# EasyEDA Pro project FPGC-CycloneIV-AIO.eprj, board PCB1
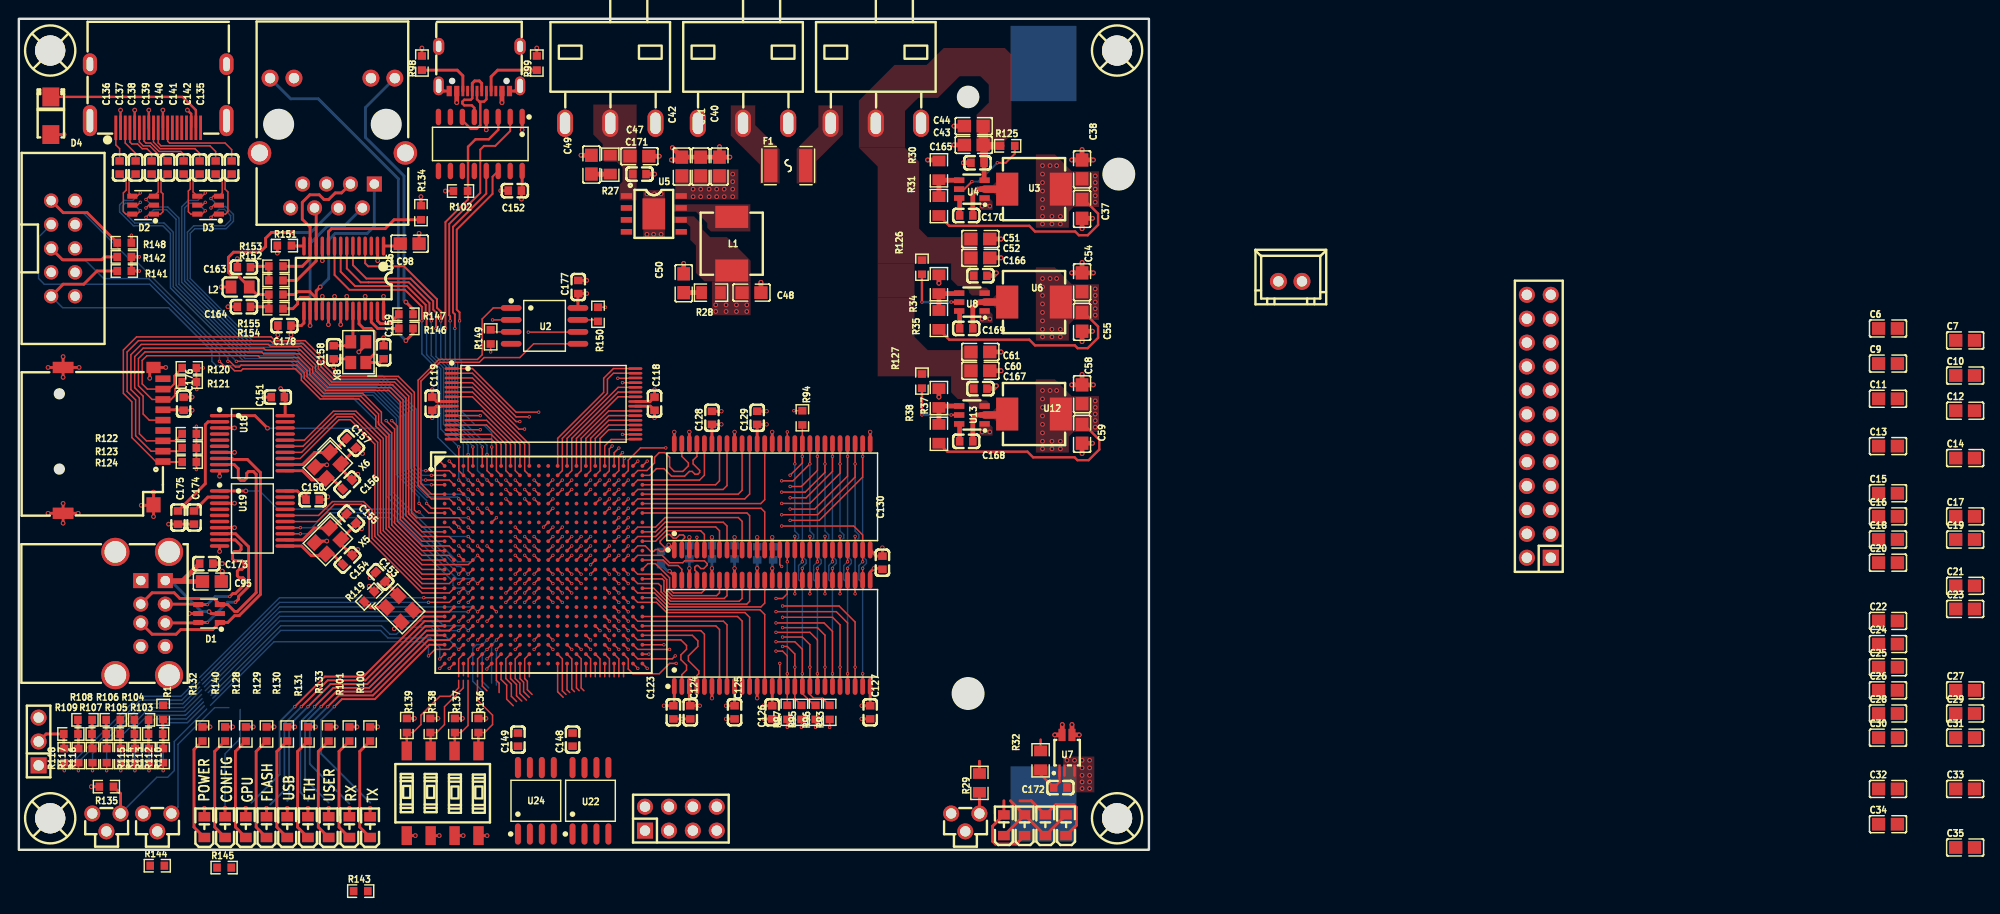
[diagram p4: board, top side]
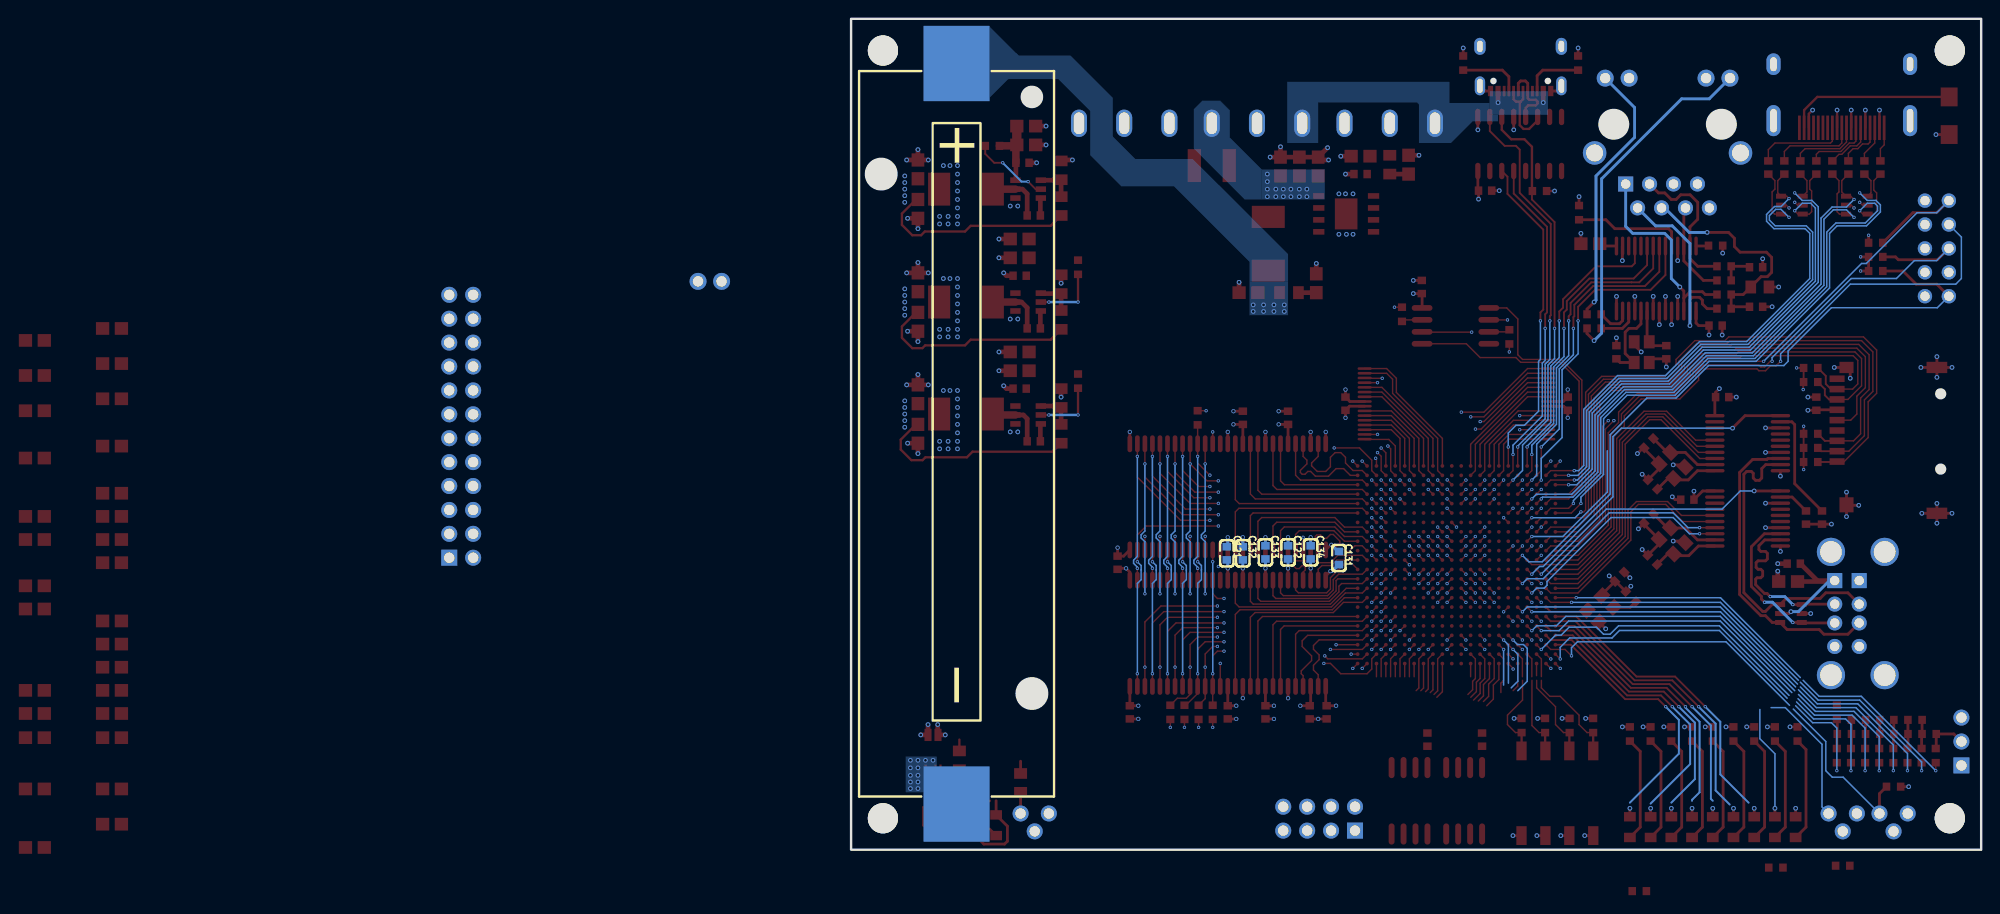
[diagram p5: board, bottom side, seen from below]

Outline 120 x 88.3 mm; copper layers: Top Layer, Inner1, Inner2, Inner3, Inner4, Bottom Layer. Coordinates in mm from the lower left corner of the outline.
Outline path: rectangle 0,88.3 120,0
Stack: Top Layer 0.035mm Outer layer thickness 1oz / Dielectric1 0.0994mm 3313 RC57% 4.2mil / Inner1 0.0152mm Inner layer thickness / Dielectric2 0.55mm 0.55mm H/H No copper / Inner2 0.0152mm Inner layer thickness / Dielectric3 0.1088mm 2116 RC54% 4.9mil / Inner3 0.0152mm Inner layer thickness / Dielectric4 0.55mm 0.55mm H/H No copper / Inner4 0.0152mm Inner layer thickness / Dielectric5 0.0994mm 3313 RC57% 4.2mil / Bottom Layer 0.035mm Outer layer thickness 1oz

## Design rules (mm)
net HDMI_D2P: DP1
net HDMI_D2N: DP1
net HDMI_D1P: DP2
net HDMI_D1N: DP2
net HDMI_D0P: DP3
net HDMI_D0N: DP3
net HDMI_CLKP: DP4
net HDMI_CLKN: DP4
net $6N7003: DP6
net $6N7006: DP6
net $6N102284: DP5
net $6N102280: DP5
template: JLCPCB Capability(Multiple Layers Board)
spacing copperThickness1oz (default): track to track 0.102, other pairs 0.152 to 0.3
spacing copperThickness2oz: track to track 0.203, other pairs 0.152 to 0.3
spacing copperThicknessInner0.5oz: track to track 0.089, other pairs 0.152 to 0.3
track width copperThickness1oz (default): min 0.102, default 0.254, max 2.54
track width copperThickness2oz: min 0.203, default 0.254, max 2.54
track width copperThickness0.5oz: min 0.089, default 0.254, max 2.54
differential pair differentialPair (default): width min 0.127, default 0.254, max 2.54; gap min 0.152, default 0.152
via viaSize (default): diameter min 0.3, default 0.61, max 10; hole min 0.2, default 0.305, max 6.3

## Placement (name value [footprint] x y rotation side)
BAT1  1042  [BAT-SMD_1042P]  108.8 44.2 90 bottom
C6  10nF  [C0805]  198.48 55.39 0 top
C7  10nF  [C0805]  206.67 54.12 0 top
C9  10nF  [C0805]  198.48 51.66 0 top
C10  10nF  [C0805]  206.67 50.39 0 top
C11  10nF  [C0805]  198.48 47.92 0 top
C12  10nF  [C0805]  206.67 46.65 0 top
C13  10nF  [C0805]  198.48 42.89 0 top
C14  10nF  [C0805]  206.67 41.62 0 top
C15  10nF  [C0805]  198.48 37.88 0 top
C16  10nF  [C0805]  198.48 35.42 0 top
C17  100nF  [C0805]  206.67 35.42 0 top
C18  10nF  [C0805]  198.48 32.96 0 top
C19  100nF  [C0805]  206.67 32.96 0 top
C20  10nF  [C0805]  198.48 30.5 0 top
C21  10uF  [C0805]  206.67 28.04 0 top
C22  100nF  [C0805]  198.48 24.31 0 top
C23  10uF  [C0805]  206.67 25.58 0 top
C24  100nF  [C0805]  198.48 21.85 0 top
C25  100nF  [C0805]  198.48 19.39 0 top
C26  100nF  [C0805]  198.48 16.93 0 top
C27  100nF  [C0805]  206.67 16.93 0 top
C28  100nF  [C0805]  198.48 14.47 0 top
C29  100nF  [C0805]  206.67 14.47 0 top
C30  100nF  [C0805]  198.48 11.91 0 top
C31  100nF  [C0805]  206.67 11.91 0 top
C32  100nF  [C0805]  198.48 6.46 0 top
C33  100nF  [C0805]  206.67 6.46 0 top
C34  100nF  [C0805]  198.48 2.71 0 top
C35  10uF  [C0805]  206.67 0.24 0 top
C37  22uF  [C0805]  112.9 68.1 90 top
C38  22uF  [C0805]  112.9 72.3 270 top
C40  22uF  [C0805]  74.4 72.6 270 top
C41  22uF  [C0805]  72.4 72.6 270 top
C42  22uF  [C0805]  70.4 72.6 270 top
C43  10uF  [C0805]  101.4 74.9 0 top
C44  10uF  [C0805]  101.4 76.9 0 top
C47  10uF  [C0805]  65.9 73.7 180 top
C48  10uF  [C0805]  77.8 59.2 180 top
C49  10uF  [C0805]  60.8 72.8 270 top
C50  10uF  [C0805]  70.6 60.2 270 top
C51  10uF  [C0805]  102.1 64.9 180 top
C52  10uF  [C0805]  102.1 62.9 180 top
C54  22uF  [C0805]  112.9 60.3 270 top
C55  22uF  [C0805]  112.9 56.1 90 top
C58  22uF  [C0805]  112.9 48.4 270 top
C59  22uF  [C0805]  112.9 44.2 90 top
C60  10uF  [C0805]  102.1 50.9 180 top
C61  10uF  [C0805]  102.1 52.9 180 top
C95  22uF  [C0805]  20.5 28.5 0 top
C98  10uF  [C0805]  41.5 64.4 180 top
C118  100nF  [C0603]  67.5 47.4 90 top
C119  100nF  [C0603]  43.9 47.4 90 top
C121  100nF  [C0603]  80.1 31.5 270 bottom
C122  100nF  [C0603]  73.6 31.6 90 bottom
C123  100nF  [C0603]  69.5 14.6 270 top
C124  100nF  [C0603]  71.3 14.6 270 top
C125  100nF  [C0603]  76 14.6 270 top
C126  100nF  [C0603]  80 14.6 270 top
C127  100nF  [C0603]  90.4 14.6 270 top
C128  100nF  [C0603]  73.6 45.9 90 top
C129  100nF  [C0603]  78.4 45.9 90 top
C130  100nF  [C0603]  91.7 30.5 270 top
C131  100nF  [C0603]  68.2 31 270 bottom
C132  100nF  [C0603]  78.4 31.5 90 bottom
C133  100nF  [C0603]  76 31.6 270 bottom
C134  100nF  [C0603]  71.2 31.6 270 bottom
C135  100nF  [C0603]  22.6 72.5 90 top
C136  100nF  [C0603]  10.7 72.5 90 top
C137  100nF  [C0603]  12.4 72.5 90 top
C138  100nF  [C0603]  14.1 72.5 90 top
C139  100nF  [C0603]  15.8 72.5 90 top
C140  100nF  [C0603]  17.5 72.5 90 top
C141  100nF  [C0603]  19.2 72.5 90 top
C142  100nF  [C0603]  20.9 72.5 90 top
C148  100nF  [C0603]  58.8 11.7 90 top
C149  100nF  [C0603]  53 11.7 90 top
C150  100nF  [C0603]  31.2 37.2 0 top
C151  100nF  [C0603]  27.5 48.1 0 top
C152  100nF  [C0603]  52.67 70.04 180 top
C153  100nF  [C0603]  38.4 29 135 top
C154  22pF  [C0603]  34.9 30.8 225 top
C155  22pF  [C0603]  35.3 35.2 135 top
C156  22pF  [C0603]  34.87 38.82 225 top
C157  22pF  [C0603]  35.3 43.2 135 top
C158  22pF  [C0603]  33.43 52.87 90 top
C159  22pF  [C0603]  38.73 52.87 270 top
C163  100nF  [C0603]  23.9 61.9 180 top
C164  100nF  [C0603]  23.9 57.7 180 top
C165  100nF  [C0603]  101.8 73 0 top
C166  100nF  [C0603]  102.1 61 180 top
C167  100nF  [C0603]  102.1 49 180 top
C168  100nF  [C0603]  100.6 43.4 0 top
C169  100nF  [C0603]  100.6 55.4 0 top
C170  100nF  [C0603]  100.6 67.4 0 top
C171  100nF  [C0603]  65.9 71.8 0 top
C172  100nF  [C0603]  110.6 6.6 180 top
C173  100nF  [C0603]  19.9 30.4 180 top
C174  100nF  [C0603]  18.6 35.3 90 top
C175  100nF  [C0603]  16.9 35.3 270 top
C176  100nF  [C0603]  17.5 47.4 90 top
C177  100nF  [C0603]  59.4 59.8 90 top
C178  100nF  [C0603]  28.2 55.7 180 top
CARD1  TF PUSH  [TF-SMD_TF-PUSH]  10 43.5 270 top
CN1  XH-2A  [CONN-TH_XH-2A]  135 60.4 0 top
D1  SRV05-4  [SOT-23-6_L2.9-W1.6-P0.95-LS2.8-BL]  20.2 25.1 90 top
D2  SRV05-4  [SOT-23-6_L2.9-W1.6-P0.95-LS2.8-BL]  13.2 68.5 90 top
D3  SRV05-4  [SOT-23-6_L2.9-W1.6-P0.95-LS2.8-BL]  20.1 68.5 90 top
D4  SS34  [SMA_L4.2-W2.7-LS5.0-RD]  3.4 78 270 top
F1  MF-MSMF110/16-2  [F1812]  81.7 72.7 180 top
H1  PZ254V-12-24P  [HDR-TH_24P-P2.54-V-M-R2-C12-S2.54]  161.4 45 90 top
H2  PZ254V-11-03P  [HDR-TH_3P-P2.54-V-M]  2.1 11.5 90 top
H3  PZ254V-12-8P  [HDR-TH_8P-P2.54-V-M-R2-C4-S2.54]  70.3 3.3 0 top
HDMI1  HDMI 19PIN 043  [HDMI-SMD_HDMI-19PIN-043]  14.8 80.1 180 top
J1  HR911105A  [RJ45-TH_HR911105A]  33.3 75.1 180 top
L1  1uH  [IND-SMD_L7.2-W6.6_GPSR0730]  75.7 64.4 270 top
L2  BLM21PG221SN1D  [L0805]  23.5 59.8 180 top
LED1  XL-2012SURC  [LED0805-RD_RED]  21.9 2.4 90 top
LED2  XL-2012SURC  [LED0805-RD_RED]  104.6 2.6 90 top
LED3  XL-2012SURC  [LED0805-RD_RED]  106.8 2.6 90 top
LED4  XL-2012SURC  [LED0805-RD_RED]  109 2.6 90 top
LED5  XL-2012SURC  [LED0805-RD_RED]  111.2 2.6 90 top
LED6  XL-2012SURC  [LED0805-RD_RED]  24.1 2.4 90 top
LED7  XL-2012SURC  [LED0805-RD_RED]  26.3 2.4 90 top
LED8  XL-2012SURC  [LED0805-RD_RED]  28.5 2.4 90 top
LED9  XL-2012SURC  [LED0805-RD_RED]  30.7 2.4 90 top
LED10  XL-2012SURC  [LED0805-RD_RED]  19.7 2.4 90 top
LED11  XL-2012SURC  [LED0805-RD_RED]  32.9 2.4 90 top
LED12  XL-2012SURC  [LED0805-RD_RED]  37.3 2.4 90 top
LED13  XL-2012SURC  [LED0805-RD_RED]  35.1 2.4 90 top
P1  2.54-2*5P简牛  [IDC-TH_10P-P2.54_C5665]  4.7 63.9 270 top
R27  2Ω  [R0805]  62.8 72.8 90 top
R28  2Ω  [R0805]  73.5 59.2 0 top
R29  10kΩ  [R0805]  102 7.1 90 top
R30  10kΩ  [R0805]  97.7 72.2 270 top
R31  33kΩ  [R0805]  97.7 68.4 270 top
R32  1kΩ  [R0805]  108.5 9.5 270 top
R34  33kΩ  [R0805]  97.7 60.1 90 top
R35  75kΩ  [R0805]  97.7 56.3 270 top
R37  100kΩ  [R0805]  97.7 48 90 top
R38  56kΩ  [R0805]  97.7 44.2 270 top
R93  4.7kΩ  [R0603]  86.1 14.6 90 top
R94  4.7kΩ  [R0603]  83.2 45.9 270 top
R95  4.7kΩ  [R0603]  83.1 14.6 90 top
R96  4.7kΩ  [R0603]  84.6 14.6 90 top
R97  4.7kΩ  [R0603]  81.6 14.6 90 top
R98  5.1kΩ  [R0603]  42.8 83.6 90 top
R99  5.1kΩ  [R0603]  55 83.6 90 top
R100  4.7kΩ  [R0603]  37.3 12.3 270 top
R101  4.7kΩ  [R0603]  35.1 12.3 270 top
R102  10kΩ  [R0603]  46.9 70 0 top
R103  10kΩ  [R0603]  14.52 12.3 0 top
R104  10kΩ  [R0603]  13.02 13.8 0 top
R105  10kΩ  [R0603]  11.52 12.3 0 top
R106  10kΩ  [R0603]  10.02 13.8 0 top
R107  10kΩ  [R0603]  8.52 12.3 0 top
R108  10kΩ  [R0603]  7.02 13.8 0 top
R109  10kΩ  [R0603]  5.52 12.3 0 top
R110  20kΩ  [R0603]  15.32 10 270 top
R111  20kΩ  [R0603]  15.32 14.6 270 top
R112  20kΩ  [R0603]  13.82 10 270 top
R113  20kΩ  [R0603]  12.32 10 270 top
R114  20kΩ  [R0603]  10.82 10 270 top
R115  20kΩ  [R0603]  9.32 10 270 top
R116  20kΩ  [R0603]  7.82 10 270 top
R117  20kΩ  [R0603]  6.32 10 270 top
R118  20kΩ  [R0603]  4.82 10 270 top
R119  4.7kΩ  [R0603]  37.2 26.9 45 top
R120  10kΩ  [R0603]  18.1 51.2 0 top
R121  10kΩ  [R0603]  18.1 49.7 0 top
R122  10kΩ  [R0603]  18.1 44.2 0 top
R123  10kΩ  [R0603]  18.1 42.7 0 top
R124  10kΩ  [R0603]  18.1 41.2 0 top
R125  10kΩ  [R0603]  105 74.8 0 top
R126  10kΩ  [R0603]  95.9 61.9 270 top
R127  10kΩ  [R0603]  95.9 49.8 270 top
R128  4.7kΩ  [R0603]  24.1 12.3 270 top
R129  4.7kΩ  [R0603]  26.3 12.3 270 top
R130  4.7kΩ  [R0603]  28.5 12.3 270 top
R131  4.7kΩ  [R0603]  30.7 12.3 270 top
R132  4.7kΩ  [R0603]  19.5 12.3 270 top
R133  4.7kΩ  [R0603]  32.9 12.3 270 top
R134  10kΩ  [R0603]  42.7 67.7 90 top
R135  10kΩ  [R0603]  9.3 6.7 0 top
R136  10kΩ  [R0603]  48.8 13.2 270 top
R137  10kΩ  [R0603]  46.3 13.2 270 top
R138  10kΩ  [R0603]  43.7 13.2 270 top
R139  10kΩ  [R0603]  41.2 13.2 270 top
R140  4.7kΩ  [R0603]  21.9 12.3 270 top
R141  10kΩ  [R0603]  11.2 61.5 180 top
R142  10kΩ  [R0603]  11.2 63 180 top
R143  10kΩ  [R0603]  36.3 -4.4 0 top
R144  10kΩ  [R0603]  14.7 -1.7 0 top
R145  10kΩ  [R0603]  21.8 -1.9 0 top
R146  1kΩ  [R0603]  41.1 55.4 0 top
R147  1kΩ  [R0603]  41.1 56.9 0 top
R148  1kΩ  [R0603]  11.2 64.5 0 top
R149  1kΩ  [R0603]  50.1 54.5 90 top
R150  1kΩ  [R0603]  61.5 56.9 90 top
R151  2.32kΩ  [R0603]  28.2 64.2 0 top
R152  49.9Ω  [R0603]  27.3 60.5 180 top
R153  49.9Ω  [R0603]  27.3 62 180 top
R154  49.9Ω  [R0603]  27.3 57.5 180 top
R155  49.9Ω  [R0603]  27.3 59 180 top
SCREW1  -  [Screw-Hole-M3]  3.39 84.87 0 top
SCREW2  -  [Screw-Hole-M3]  116.68 84.87 0 top
SCREW3  -  [Screw-Hole-M3]  3.39 3.28 0 top
SCREW4  -  [Screw-Hole-M3]  116.68 3.28 0 top
SW2  TS-1009B-05026  [SW-TH_3P-L4.5-W3.8-P3.10-LS1.9]  14.7 2.9 0 top
SW3  TS-1009B-05026  [SW-TH_3P-L4.5-W3.8-P3.10-LS1.9]  100.5 2.9 0 top
SW4  TS-1009B-05026  [SW-TH_3P-L4.5-W3.8-P3.10-LS1.9]  9.3 2.9 0 top
SW5  2.54-4P TPGT  [SW-SMD_8P-L10.2-W6.2-P2.54-LS9.4]  45 6 90 top
U2  W25Q64JVSSIQ  [SOP-8_L5.3-W5.3-P1.27-LS8.0-BL]  55.82 55.67 270 top
U3  4.7uH  [IND-SMD_L7.2-W6.6_GPSR07X0]  107.8 70.2 180 top
U4  TPS563201DDCR  [SOT-23-6_L2.9-W1.6-P0.95-LS2.8-BR]  101.2 70.2 0 top
U5  IP5306  [ESOP-8_L4.9-W3.9-P1.27-LS6.0-BL-EP]  67.43 67.57 270 top
U6  4.7uH  [IND-SMD_L7.2-W6.6_GPSR07X0]  107.8 58.2 180 top
U7  XB7608AJ  [CPC-5_L2.6-W2.6-P0.53-LS4.0-BL]  111.3 10.3 0 top
U8  TPS563201DDCR  [SOT-23-6_L2.9-W1.6-P0.95-LS2.8-BR]  101.2 58.2 0 top
U9  SS12D10G6-WJ  [SW-TH_3P-P4.80_HX-SS12D10G6-WJ]  62.8 77.2 180 top
U10  SS12D10G6-WJ  [SW-TH_3P-P4.80_HX-SS12D10G6-WJ]  91 77.2 180 top
U11  SS12D10G6-WJ  [SW-TH_3P-P4.80_HX-SS12D10G6-WJ]  76.9 77.2 180 top
U12  4.7uH  [IND-SMD_L7.2-W6.6_GPSR07X0]  107.8 46.3 180 top
U13  TPS563201DDCR  [SOT-23-6_L2.9-W1.6-P0.95-LS2.8-BR]  101.2 46.2 0 top
U14  W9825G6KH-6  [TSOP-54_L22.2-W10.2-P0.80-LS11.8-BL]  80 23 0 top
U15  W9825G6KH-6  [TSOP-54_L22.2-W10.2-P0.80-LS11.8-BL]  80 37.5 0 top
U16  IS63WV1288DBLL-10HLI  [TSOPI-32_L18.4-W8.0-P0.50-LS20.0-TL]  55.71 47.38 0 top
U18  CH376T  [SSOP-20_L7.5-W5.2-P0.65-LS8.0-BL]  24.8 43.2 270 top
U19  CH376T  [SSOP-20_L7.5-W5.2-P0.65-LS8.0-BL]  24.8 35.2 270 top
U22  W25Q128JVSIQ  [SOIC-8_L5.3-W5.3-P1.27-LS8.0-BL]  60.7 5.2 0 top
U23  CH340C  [SOP-16_L10.0-W3.9-P1.27-LS6.0-BL]  49 75 180 top
U24  W25Q128JVSIQ  [SOIC-8_L5.3-W5.3-P1.27-LS8.0-BL]  54.9 5.2 0 top
U25  EP4CE40F23I7N  [FBGA-484_L23.0-W23.0-R22-C22-P1.00-TL]  55.71 30.28 0 top
U26  ENC28J60-I/SS  [SSOP-28_L10.2-W5.3-P0.65-LS7.8-BL]  34.5 60.7 180 top
USB1  AF SS-JB17.6  [USB-A-TH_AF-SS-JB17.6]  13.1 25.1 270 top
USB2  TYPE-C 16PIN 2MD(073)  [USB-C-SMD_TYPE-C-6PIN-2MD-073]  48.9 83 180 top
X1  50MHz  [OSC-SMD_4P-L3.2-W2.5-BL]  40.43 25.6 315 top
X5  12MHz  [CRYSTAL-SMD_4P-L3.2-W2.5-BL]  32.82 32.81 225 top
X6  12MHz  [CRYSTAL-SMD_4P-L3.2-W2.5-BL]  32.81 40.84 225 top
X8  25MHz  [CRYSTAL-SMD_4P-L3.2-W2.5-BL-2]  36.05 52.88 90 top

## Footprints (pads in the part's own frame, mm; a bottom-side part is the same pattern mirrored in y, then rotated)
BAT-SMD_1042P
  rect 8x7 smd: 1(-39.35,0) 2(39.35,0)
C0603
  rect 0.8x0.9 smd: 1(-0.7,0) 2(0.7,0)
C0805
  rect 1.41x1.35 smd: 1(-1,0) 2(1,0)
CONN-TH_XH-2A
  round 1.8 hole 1.1: 1(-1.251,0) 2(1.251,0)
CPC-5_L2.6-W2.6-P0.53-LS4.0-BL
  rect 0.25x1.3 smd: 1(-0.795,-1.9) 2(-0.265,-1.9) 3(0.795,-1.9)
  rect 0.75x1.3 smd: 4(0.53,1.9) 5(-0.53,1.9)
CRYSTAL-SMD_4P-L3.2-W2.5-BL
  rect 1.4x1.2 smd: 1(-1.1,-0.85) 2(1.1,-0.85) 3(1.1,0.85) 4(-1.1,0.85)
CRYSTAL-SMD_4P-L3.2-W2.5-BL-2
  rect 1.4x1.15 smd: 1(-1.1,-0.8) 2(1.1,-0.8) 3(1.1,0.8) 4(-1.1,0.8)
ESOP-8_L4.9-W3.9-P1.27-LS6.0-BL-EP
  rect 0.6x1.2 smd: 1(-1.905,-2.909) 2(-0.635,-2.909) 3(0.635,-2.909) 4(1.905,-2.909) 5(1.905,2.909) 6(0.635,2.909) 7(-0.635,2.909) 8(-1.905,2.909)
  rect 3.3x2.4 smd: 9(0,0)
F1812
  rect 1.407x3.499 smd: 1(-1.853,0) 2(1.853,0)
FBGA-484_L23.0-W23.0-R22-C22-P1.00-TL
  round 0.4 smd: A1(-10.501,10.501) A2(-9.5,10.501) A3(-8.5,10.501) A4(-7.5,10.501) A5(-6.5,10.501) A6(-5.5,10.501) A7(-4.5,10.501) A8(-3.5,10.501) A9(-2.5,10.501) A10(-1.5,10.501) A11(-0.5,10.501) A12(0.5,10.501) A13(1.5,10.501) A14(2.5,10.501) A15(3.5,10.501) A16(4.5,10.501) A17(5.5,10.501) A18(6.5,10.501) A19(7.5,10.501) A20(8.5,10.501) A21(9.499,10.501) A22(10.501,10.501) AA1(-10.501,-9.499) AA2(-9.5,-9.499) AA3(-8.5,-9.499) AA4(-7.5,-9.499) AA5(-6.5,-9.499) AA6(-5.5,-9.499) AA7(-4.5,-9.499) AA8(-3.5,-9.499) AA9(-2.5,-9.499) AA10(-1.5,-9.499) AA11(-0.5,-9.499) AA12(0.5,-9.499) AA13(1.5,-9.499) AA14(2.5,-9.499) AA15(3.5,-9.499) AA16(4.5,-9.499) AA17(5.5,-9.499) AA18(6.5,-9.499) AA19(7.5,-9.499) AA20(8.5,-9.499) AA21(9.499,-9.499) AA22(10.501,-9.499) AB1(-10.501,-10.501) AB2(-9.5,-10.501) AB3(-8.5,-10.501) AB4(-7.5,-10.501) AB5(-6.5,-10.501) AB6(-5.5,-10.501) AB7(-4.5,-10.501) AB8(-3.5,-10.501) AB9(-2.5,-10.501) AB10(-1.5,-10.501) AB11(-0.5,-10.501) AB12(0.5,-10.501) AB13(1.5,-10.501) AB14(2.5,-10.501) AB15(3.5,-10.501) AB16(4.5,-10.501) AB17(5.5,-10.501) AB18(6.5,-10.501) AB19(7.5,-10.501) AB20(8.5,-10.501) AB21(9.499,-10.501) AB22(10.501,-10.501) B1(-10.501,9.5) B2(-9.5,9.5) B3(-8.5,9.5) B4(-7.5,9.5) B5(-6.5,9.5) B6(-5.5,9.5) B7(-4.5,9.5) B8(-3.5,9.5) B9(-2.5,9.5) B10(-1.5,9.5) B11(-0.5,9.5) B12(0.5,9.5) B13(1.5,9.5) B14(2.5,9.5) B15(3.5,9.5) B16(4.5,9.5) B17(5.5,9.5) B18(6.5,9.5) B19(7.5,9.5) B20(8.5,9.5) B21(9.499,9.5) B22(10.501,9.5) C1(-10.501,8.5) C2(-9.5,8.5) C3(-8.5,8.5) C4(-7.5,8.5) C5(-6.5,8.5) C6(-5.5,8.5) C7(-4.5,8.5) C8(-3.5,8.5) C9(-2.5,8.5) C10(-1.5,8.5) C11(-0.5,8.5) C12(0.5,8.5) C13(1.5,8.5) C14(2.5,8.5) C15(3.5,8.5) C16(4.5,8.5) C17(5.5,8.5) C18(6.5,8.5) C19(7.5,8.5) C20(8.5,8.5) C21(9.499,8.5) C22(10.501,8.5) D1(-10.501,7.5) D2(-9.5,7.5) D3(-8.5,7.5) D4(-7.5,7.5) D5(-6.5,7.5) D6(-5.5,7.5) D7(-4.5,7.5) D8(-3.5,7.5) D9(-2.5,7.5) D10(-1.5,7.5) D11(-0.5,7.5) D12(0.5,7.5) D13(1.5,7.5) D14(2.5,7.5) D15(3.5,7.5) D16(4.5,7.5) D17(5.5,7.5) D18(6.5,7.5) D19(7.5,7.5) D20(8.5,7.5) D21(9.499,7.5) D22(10.501,7.5) E1(-10.501,6.5) E2(-9.5,6.5) E3(-8.5,6.5) E4(-7.5,6.5) E5(-6.5,6.5) E6(-5.5,6.5) E7(-4.5,6.5) E8(-3.5,6.5) E9(-2.5,6.5) E10(-1.5,6.5) E11(-0.5,6.5) E12(0.5,6.5) E13(1.5,6.5) E14(2.5,6.5) E15(3.5,6.5) E16(4.5,6.5) E17(5.5,6.5) E18(6.5,6.5) E19(7.5,6.5) E20(8.5,6.5) E21(9.499,6.5) E22(10.501,6.5) F1(-10.501,5.5) F2(-9.5,5.5) F3(-8.5,5.5) F4(-7.5,5.5) F5(-6.5,5.5) F6(-5.5,5.5) F7(-4.5,5.5) F8(-3.5,5.5) F9(-2.5,5.5) F10(-1.5,5.5) F11(-0.5,5.5) F12(0.5,5.5) F13(1.5,5.5) F14(2.5,5.5) F15(3.5,5.5) F16(4.5,5.5) F17(5.5,5.5) F18(6.5,5.5) F19(7.5,5.5) F20(8.5,5.5) F21(9.499,5.5) F22(10.501,5.5) G1(-10.501,4.5) G2(-9.5,4.5) G3(-8.5,4.5) G4(-7.5,4.5) G5(-6.5,4.5) G6(-5.5,4.5) G7(-4.5,4.5) G8(-3.5,4.5) G9(-2.5,4.5) G10(-1.5,4.5) G11(-0.5,4.5) G12(0.5,4.5) G13(1.5,4.5) G14(2.5,4.5) G15(3.5,4.5) G16(4.5,4.5) G17(5.5,4.5) G18(6.5,4.5) G19(7.5,4.5) G20(8.5,4.5) G21(9.499,4.5) G22(10.501,4.5) H1(-10.501,3.5) H2(-9.5,3.5) H3(-8.5,3.5) H4(-7.5,3.5) H5(-6.5,3.5) H6(-5.5,3.5) H7(-4.5,3.5) H8(-3.5,3.5) H9(-2.5,3.5) H10(-1.5,3.5) H11(-0.5,3.5) H12(0.5,3.5) H13(1.5,3.5) H14(2.5,3.5) H15(3.5,3.5) H16(4.5,3.5) H17(5.5,3.5) H18(6.5,3.5) H19(7.5,3.5) H20(8.5,3.5) H21(9.499,3.5) H22(10.501,3.5) J1(-10.501,2.5) J2(-9.5,2.5) J3(-8.5,2.5) J4(-7.5,2.5) J5(-6.5,2.5) J6(-5.5,2.5) J7(-4.5,2.5) J8(-3.5,2.5) J9(-2.5,2.5) J10(-1.5,2.5) J11(-0.5,2.5) J12(0.5,2.5) J13(1.5,2.5) J14(2.5,2.5) J15(3.5,2.5) J16(4.5,2.5) J17(5.5,2.5) J18(6.5,2.5) J19(7.5,2.5) J20(8.5,2.5) J21(9.499,2.5) J22(10.501,2.5) K1(-10.501,1.5) K2(-9.5,1.5) K3(-8.5,1.5) K4(-7.5,1.5) K5(-6.5,1.5) K6(-5.5,1.5) K7(-4.5,1.5) K8(-3.5,1.5) K9(-2.5,1.5) K10(-1.5,1.5) K11(-0.5,1.5) K12(0.5,1.5) K13(1.5,1.5) K14(2.5,1.5) K15(3.5,1.5) K16(4.5,1.5) K17(5.5,1.5) K18(6.5,1.5) K19(7.5,1.5) K20(8.5,1.5) K21(9.499,1.5) K22(10.501,1.5) L1(-10.501,0.5) L2(-9.5,0.5) L3(-8.5,0.5) L4(-7.5,0.5) L5(-6.5,0.5) L6(-5.5,0.5) L7(-4.5,0.5) L8(-3.5,0.5) L9(-2.5,0.5) L10(-1.5,0.5) L11(-0.5,0.5) L12(0.5,0.5) L13(1.5,0.5) L14(2.5,0.5) L15(3.5,0.5) L16(4.5,0.5) L17(5.5,0.5) L18(6.5,0.5) L19(7.5,0.5) L20(8.5,0.5) L21(9.499,0.5) L22(10.501,0.5) M1(-10.501,-0.5) M2(-9.5,-0.5) M3(-8.5,-0.5) M4(-7.5,-0.5) M5(-6.5,-0.5) M6(-5.5,-0.5) M7(-4.5,-0.5) M8(-3.5,-0.5) M9(-2.5,-0.5) M10(-1.5,-0.5) M11(-0.5,-0.5) M12(0.5,-0.5) M13(1.5,-0.5) M14(2.5,-0.5) M15(3.5,-0.5) M16(4.5,-0.5) M17(5.5,-0.5) M18(6.5,-0.5) M19(7.5,-0.5) M20(8.5,-0.5) M21(9.499,-0.5) M22(10.501,-0.5) N1(-10.501,-1.5) N2(-9.5,-1.5) N3(-8.5,-1.5) N4(-7.5,-1.5) N5(-6.5,-1.5) N6(-5.5,-1.5) N7(-4.5,-1.5) N8(-3.5,-1.5) N9(-2.5,-1.5) N10(-1.5,-1.5) N11(-0.5,-1.5) N12(0.5,-1.5) N13(1.5,-1.5) N14(2.5,-1.5) N15(3.5,-1.5) N16(4.5,-1.5) N17(5.5,-1.5) N18(6.5,-1.5) N19(7.5,-1.5) N20(8.5,-1.5) N21(9.499,-1.5) N22(10.501,-1.5) P1(-10.501,-2.5) P2(-9.5,-2.5) P3(-8.5,-2.5) P4(-7.5,-2.5) P5(-6.5,-2.5) P6(-5.5,-2.5) P7(-4.5,-2.5) P8(-3.5,-2.5) P9(-2.5,-2.5) P10(-1.5,-2.5) P11(-0.5,-2.5) P12(0.5,-2.5) P13(1.5,-2.5) P14(2.5,-2.5) P15(3.5,-2.5) P16(4.5,-2.5) P17(5.5,-2.5) P18(6.5,-2.5) P19(7.5,-2.5) P20(8.5,-2.5) P21(9.499,-2.5) P22(10.501,-2.5) R1(-10.501,-3.5) R2(-9.5,-3.5) R3(-8.5,-3.5) R4(-7.5,-3.5) R5(-6.5,-3.5) R6(-5.5,-3.5) R7(-4.5,-3.5) R8(-3.5,-3.5) R9(-2.5,-3.5) R10(-1.5,-3.5) R11(-0.5,-3.5) R12(0.5,-3.5) R13(1.5,-3.5) R14(2.5,-3.5) R15(3.5,-3.5) R16(4.5,-3.5) R17(5.5,-3.5) R18(6.5,-3.5) R19(7.5,-3.5) R20(8.5,-3.5) R21(9.499,-3.5) R22(10.501,-3.5) T1(-10.501,-4.5) T2(-9.5,-4.5) T3(-8.5,-4.5) T4(-7.5,-4.5) T5(-6.5,-4.5) T6(-5.5,-4.5) T7(-4.5,-4.5) T8(-3.5,-4.5) T9(-2.5,-4.5) T10(-1.5,-4.5) T11(-0.5,-4.5) T12(0.5,-4.5) T13(1.5,-4.5) T14(2.5,-4.5) T15(3.5,-4.5) T16(4.5,-4.5) T17(5.5,-4.5) T18(6.5,-4.5) T19(7.5,-4.5) T20(8.5,-4.5) T21(9.499,-4.5) T22(10.501,-4.5) U1(-10.501,-5.5) U2(-9.5,-5.5) U3(-8.5,-5.5) U4(-7.5,-5.5) U5(-6.5,-5.5) U6(-5.5,-5.5) U7(-4.5,-5.5) U8(-3.5,-5.5) U9(-2.5,-5.5) U10(-1.5,-5.5) U11(-0.5,-5.5) U12(0.5,-5.5) U13(1.5,-5.5) U14(2.5,-5.5) U15(3.5,-5.5) U16(4.5,-5.5) U17(5.5,-5.5) U18(6.5,-5.5) U19(7.5,-5.5) U20(8.5,-5.5) U21(9.499,-5.5) U22(10.501,-5.5) V1(-10.501,-6.5) V2(-9.5,-6.5) V3(-8.5,-6.5) V4(-7.5,-6.5) V5(-6.5,-6.5) V6(-5.5,-6.5) V7(-4.5,-6.5) V8(-3.5,-6.5) V9(-2.5,-6.5) V10(-1.5,-6.5) V11(-0.5,-6.5) V12(0.5,-6.5) V13(1.5,-6.5) V14(2.5,-6.5) V15(3.5,-6.5) V16(4.5,-6.5) V17(5.5,-6.5) V18(6.5,-6.5) V19(7.5,-6.5) V20(8.5,-6.5) V21(9.499,-6.5) V22(10.501,-6.5) W1(-10.501,-7.5) W2(-9.5,-7.5) W3(-8.5,-7.5) W4(-7.5,-7.5) W5(-6.5,-7.5) W6(-5.5,-7.5) W7(-4.5,-7.5) W8(-3.5,-7.5) W9(-2.5,-7.5) W10(-1.5,-7.5) W11(-0.5,-7.5) W12(0.5,-7.5) W13(1.5,-7.5) W14(2.5,-7.5) W15(3.5,-7.5) W16(4.5,-7.5) W17(5.5,-7.5) W18(6.5,-7.5) W19(7.5,-7.5) W20(8.5,-7.5) W21(9.499,-7.5) W22(10.501,-7.5) Y1(-10.501,-8.5) Y2(-9.5,-8.5) Y3(-8.5,-8.5) Y4(-7.5,-8.5) Y5(-6.5,-8.5) Y6(-5.5,-8.5) Y7(-4.5,-8.5) Y8(-3.5,-8.5) Y9(-2.5,-8.5) Y10(-1.5,-8.5) Y11(-0.5,-8.5) Y12(0.5,-8.5) Y13(1.5,-8.5) Y14(2.5,-8.5) Y15(3.5,-8.5) Y16(4.5,-8.5) Y17(5.5,-8.5) Y18(6.5,-8.5) Y19(7.5,-8.5) Y20(8.5,-8.5) Y21(9.499,-8.5) Y22(10.501,-8.5)
HDMI-SMD_HDMI-19PIN-043
  rect 0.3x2.6 smd: 1(4.5,3.38) 2(4,3.38) 3(3.5,3.38) 4(3,3.38) 5(2.5,3.38) 6(2,3.38) 7(1.5,3.38) 8(1,3.38) 9(0.5,3.38) 10(0,3.38) 11(-0.5,3.38) 12(-1,3.38) 13(-1.5,3.38) 14(-2,3.38) 15(-2.5,3.38) 16(-3,3.38) 17(-3.5,3.38) 18(-4,3.38) 19(-4.5,3.38)
  oval 1.5x3.3 hole 0.7x2.5: 20(-7.25,2.62) 20(7.25,2.62)
  oval 1.5x2.3 hole 0.7x1.5: 20(-7.25,-3.38) 20(7.25,-3.38)
HDR-TH_3P-P2.54-V-M
  rect 1.7x1.7 hole 1.1: 1(-2.54,0)
  round 1.7 hole 1.1: 2(0,0) 3(2.54,0)
HDR-TH_8P-P2.54-V-M-R2-C4-S2.54
  rect 1.7x1.7 hole 1.1: 1(-3.81,-1.27)
  round 1.7 hole 1.1: 2(-3.81,1.27) 3(-1.27,-1.27) 4(-1.27,1.27) 5(1.27,-1.27) 6(1.27,1.27) 7(3.81,-1.27) 8(3.81,1.27)
HDR-TH_24P-P2.54-V-M-R2-C12-S2.54
  rect 1.7x1.7 hole 1.1: 1(-13.97,-1.27)
  round 1.7 hole 1.1: 2(-13.97,1.27) 3(-11.43,-1.27) 4(-11.43,1.27) 5(-8.89,-1.27) 6(-8.89,1.27) 7(-6.35,-1.27) 8(-6.35,1.27) 9(-3.81,-1.27) 10(-3.81,1.27) 11(-1.27,-1.27) 12(-1.27,1.27) 13(1.27,-1.27) 14(1.27,1.27) 15(3.81,-1.27) 16(3.81,1.27) 17(6.35,-1.27) 18(6.35,1.27) 19(8.89,-1.27) 20(8.89,1.27) 21(11.43,-1.27) 22(11.43,1.27) 23(13.97,-1.27) 24(13.97,1.27)
IDC-TH_10P-P2.54_C5665
  round 1.524 hole 1: 1(-5.08,-1.27) 2(-5.08,1.27) 3(-2.54,-1.27) 4(-2.54,1.27) 5(0,-1.27) 6(0,1.27) 7(2.54,-1.27) 8(2.54,1.27) 9(5.08,-1.27) 10(5.08,1.27)
IND-SMD_L7.2-W6.6_GPSR07X0
  rect 2.35x3.5 smd: 1(-2.85,0) 2(2.85,0)
IND-SMD_L7.2-W6.6_GPSR0730
  rect 2.35x3.5 smd: 1(-2.85,0) 2(2.85,0)
L0805
  rect 1.133x1.377 smd: 1(-0.966,0) 2(0.966,0)
LED0805-RD_RED
  rect 1x1.25 smd: 1(-1.1,0) 2(1.1,0)
OSC-SMD_4P-L3.2-W2.5-BL
  rect 1.4x1.2 smd: 1(-1.1,-0.875) 2(1.1,-0.875) 3(1.1,0.875) 4(-1.1,0.875)
R0603
  rect 0.806x0.864 smd: 1(-0.753,0) 2(0.753,0)
R0805
  rect 1.133x1.377 smd: 1(-1,0) 2(1,0)
RJ45-TH_HR911105A
  rect 1.6x1.6 hole 1: 1(-4.45,4.355)
  round 1.6 hole 1: 2(-3.18,6.895) 3(-1.91,4.355) 4(-0.64,6.895) 5(0.63,4.355) 6(1.9,6.895) 7(3.17,4.355) 8(4.44,6.895)
  round 1.8 hole 1.1: 9(-6.625,-6.895) 10(-4.085,-6.895) 11(4.085,-6.895) 12(6.625,-6.895)
  round 2.5 hole 1.8: SH1(-7.745,1.055) SH2(7.745,1.055)
Screw-Hole-M3
  round 3.2 hole 3.2: 1(-0.064,0.064)
SMA_L4.2-W2.7-LS5.0-RD
  rect 2x1.8 smd: 1(-2,0) 2(2,0)
SOIC-8_L5.3-W5.3-P1.27-LS8.0-BL
  oval 0.63x2.25 smd: 1(-1.905,-3.53) 2(-0.635,-3.53) 3(0.635,-3.53) 4(1.905,-3.53) 5(1.905,3.53) 6(0.635,3.53) 7(-0.635,3.53) 8(-1.905,3.53)
SOP-8_L5.3-W5.3-P1.27-LS8.0-BL
  oval 0.609x2.204 smd: 1(-1.905,-3.542) 2(-0.635,-3.542) 3(0.635,-3.542) 4(1.905,-3.542) 5(1.905,3.542) 6(0.635,3.542) 7(-0.635,3.542) 8(-1.905,3.542)
SOP-16_L10.0-W3.9-P1.27-LS6.0-BL
  oval 0.56x1.745 smd: 1(-4.445,-2.873) 2(-3.175,-2.873) 3(-1.905,-2.873) 4(-0.635,-2.873) 5(0.635,-2.873) 6(1.905,-2.873) 7(3.175,-2.873) 8(4.445,-2.873) 9(4.445,2.873) 10(3.175,2.873) 11(1.905,2.873) 12(0.635,2.873) 13(-0.635,2.873) 14(-1.905,2.873) 15(-3.175,2.873) 16(-4.445,2.873)
SOT-23-6_L2.9-W1.6-P0.95-LS2.8-BL
  rect 0.532x1.072 smd: 1(-0.95,-1.149) 2(0,-1.149) 3(0.95,-1.149) 4(0.95,1.149) 5(0,1.149) 6(-0.95,1.149)
SOT-23-6_L2.9-W1.6-P0.95-LS2.8-BR
  rect 1.1x0.6 smd: 1(1.35,-0.95) 2(1.35,0) 3(1.35,0.95) 4(-1.35,0.95) 5(-1.35,0) 6(-1.35,-0.95)
SSOP-20_L7.5-W5.2-P0.65-LS8.0-BL
  oval 0.364x2.069 smd: 1(-2.925,-3.482) 2(-2.275,-3.482) 3(-1.625,-3.482) 4(-0.975,-3.482) 5(-0.325,-3.482) 6(0.325,-3.482) 7(0.975,-3.482) 8(1.625,-3.482) 9(2.275,-3.482) 10(2.925,-3.482) 11(2.925,3.482) 12(2.275,3.482) 13(1.625,3.482) 14(0.975,3.482) 15(0.325,3.482) 16(-0.325,3.482) 17(-0.975,3.482) 18(-1.625,3.482) 19(-2.275,3.482) 20(-2.925,3.482)
SSOP-28_L10.2-W5.3-P0.65-LS7.8-BL
  oval 0.364x2.015 smd: 1(-4.225,-3.455) 2(-3.575,-3.455) 3(-2.925,-3.455) 4(-2.275,-3.455) 5(-1.625,-3.455) 6(-0.975,-3.455) 7(-0.325,-3.455) 8(0.325,-3.455) 9(0.975,-3.455) 10(1.625,-3.455) 11(2.275,-3.455) 12(2.925,-3.455) 13(3.575,-3.455) 14(4.225,-3.455) 15(4.225,3.455) 16(3.575,3.455) 17(2.925,3.455) 18(2.275,3.455) 19(1.625,3.455) 20(0.975,3.455) 21(0.325,3.455) 22(-0.325,3.455) 23(-0.975,3.455) 24(-1.625,3.455) 25(-2.275,3.455) 26(-2.925,3.455) 27(-3.575,3.455) 28(-4.225,3.455)
SW-SMD_8P-L10.2-W6.2-P2.54-LS9.4
  rect 2x1.1 smd: 1(-4.5,3.81) 2(-4.5,1.27) 3(-4.5,-1.27) 4(-4.5,-3.81) 5(4.5,-3.81) 6(4.5,-1.27) 7(4.5,1.27) 8(4.5,3.81)
SW-TH_3P-L4.5-W3.8-P3.10-LS1.9
  round 1.7 hole 1.1: 1(1.5,0.95) 2(-1.5,0.95) 3(0,-0.95)
SW-TH_3P-P4.80_HX-SS12D10G6-WJ
  oval 1.7x2.9 hole 1.1x2.3: 1(-4.8,0) 2(0,0) 3(4.8,0)
TF-SMD_TF-PUSH
  rect 0.7x1.6 smd: 1(2.25,5.3) 2(1.15,5.3) 3(0.05,5.3) 4(-1.05,5.3) 5(-2.15,5.3) 6(-3.25,5.3) 7(-4.35,5.3) 8(-5.45,5.3) CD(-6.55,5.3)
  rect 1.2x1.5 smd: 10(-7.75,4.3)
  rect 1.2x2.2 smd: 11(-7.75,-5.3) 12(7.75,-5.3)
  rect 1.6x1.5 smd: 13(6.85,4.3)
TSOP-54_L22.2-W10.2-P0.80-LS11.8-BL
  oval 0.5x1.8 smd: 1(-10.4,-5.642) 2(-9.6,-5.642) 3(-8.8,-5.642) 4(-8,-5.642) 5(-7.2,-5.642) 6(-6.4,-5.642) 7(-5.6,-5.642) 8(-4.8,-5.642) 9(-4,-5.642) 10(-3.2,-5.642) 11(-2.4,-5.642) 12(-1.6,-5.642) 13(-0.8,-5.642) 14(0,-5.642) 15(0.8,-5.642) 16(1.6,-5.642) 17(2.4,-5.642) 18(3.2,-5.642) 19(4,-5.642) 20(4.8,-5.642) 21(5.6,-5.642) 22(6.4,-5.642) 23(7.2,-5.642) 24(8,-5.642) 25(8.8,-5.642) 26(9.6,-5.642) 27(10.4,-5.642) 28(10.4,5.642) 29(9.6,5.642) 30(8.8,5.642) 31(8,5.642) 32(7.2,5.642) 33(6.4,5.642) 34(5.6,5.642) 35(4.8,5.642) 36(4,5.642) 37(3.2,5.642) 38(2.4,5.642) 39(1.6,5.642) 40(0.8,5.642) 41(0,5.642) 42(-0.8,5.642) 43(-1.6,5.642) 44(-2.4,5.642) 45(-3.2,5.642) 46(-4,5.642) 47(-4.8,5.642) 48(-5.6,5.642) 49(-6.4,5.642) 50(-7.2,5.642) 51(-8,5.642) 52(-8.8,5.642) 53(-9.6,5.642) 54(-10.4,5.642)
TSOPI-32_L18.4-W8.0-P0.50-LS20.0-TL
  oval 1.5x0.28 smd: 1(-9.75,3.75) 2(-9.75,3.25) 3(-9.75,2.75) 4(-9.75,2.25) 5(-9.75,1.75) 6(-9.75,1.25) 7(-9.75,0.75) 8(-9.75,0.25) 9(-9.75,-0.25) 10(-9.75,-0.75) 11(-9.75,-1.25) 12(-9.75,-1.75) 13(-9.75,-2.25) 14(-9.75,-2.75) 15(-9.75,-3.25) 16(-9.75,-3.75) 17(9.75,-3.75) 18(9.75,-3.25) 19(9.75,-2.75) 20(9.75,-2.25) 21(9.75,-1.75) 22(9.75,-1.25) 23(9.75,-0.75) 24(9.75,-0.25) 25(9.75,0.25) 26(9.75,0.75) 27(9.75,1.25) 28(9.75,1.75) 29(9.75,2.25) 30(9.75,2.75) 31(9.75,3.25) 32(9.75,3.75)
USB-A-TH_AF-SS-JB17.6
  rect 1.6x1.6 hole 1: 1(-3.5,2.45) 5(-3.5,-0.15)
  round 1.6 hole 1: 2(-1,2.45) 3(1,2.45) 4(3.5,2.45) 6(-1,-0.15) 7(1,-0.15) 8(3.5,-0.15)
  round 3 hole 2.3: 9(-6.55,2.85) 10(6.55,2.85) 11(-6.55,-2.85) 12(6.55,-2.85)
USB-C-SMD_TYPE-C-6PIN-2MD-073
  rect 0.55x1.1 smd: 1(-3.2,2.375) 2(-2.4,2.375) 11(2.4,2.375) 12(3.2,2.375)
  rect 0.3x1.1 smd: 3(-1.75,2.375) 4(-1.25,2.375) 5(-0.75,2.375) 6(-0.25,2.375) 7(0.25,2.375) 8(0.75,2.375) 9(1.25,2.375) 10(1.75,2.375)
  oval 1.1x2 hole 0.6x1.5: 13(-4.325,1.825) 14(4.325,1.825)
  oval 1.2x1.8 hole 0.6x1.2: 13(-4.325,-2.375) 14(4.325,-2.375)

## Nets
As in the schematic.

Pads without a net: CARD1 CD; HDMI1 13 14 15 16 19; J1 5 7; P1 6 7 8; U9 1; U10 1; U14 40; U15 40; U18 4 5 6 17 18 19; U19 4 5 6 17 18 19; U23 7 8 9 10 11 12 15; U25 A3 A11 A12 AA8 AA9 AA10 AA11 AA12 AA13 AA14 AA15 AA16 AA17 AA18 AA19 AB4 AB7 AB8 AB9 AB10 AB11 AB12 AB13 AB14 AB15 AB16 AB17 AB18 AB19 AB20 B5 B11 B12 C10 C15 D2 D6 D7 D15 D17 D20 E1 E5 E6 E7 E9 E13 E14 E15 E16 F7 F8 F9 F10 F11 F13 F14 F15 F16 F17 G1 G5 G7 G8 G9 G10 G11 G13 G14 G15 G16 G17 G18 G21 G22 H5 H6 H7 H8 H10 H11 H14 H15 H16 H17 H18 J3 J5 J6 J7 J8 J17 J18 K7 K8 K17 K19 K22 L6 L7 L8 M5 M6 M7 M8 M16 N7 N8 N16 N17 N18 P5 P7 P15 P16 P17 P20 R5 R6 R7 R14 R15 R16 R17 R18 T1 T3 T7 T8 T9 T10 T11 T12 T13 T14 T15 T16 T17 T18 T21 T22 U7 U8 U9 U10 U11 U12 U13 U14 U15 U16 U17 V5 V6 V7 V8 V9 V10 V11 V12 V13 V14 V15 V16 W8 W10 W13 W14 W15 W17 W19 Y4 Y8 Y10 Y13 Y17; U26 3 5; USB2 3 9

## Via types
v1: diameter 0.5, hole 0.3, Top Layer to Bottom Layer, 254 vias
v2: diameter 0.35, hole 0.2, Top Layer to Bottom Layer, 369 vias
v3: diameter 0.45, hole 0.3, Top Layer to Bottom Layer, 38 vias

## Routing (per net, layer and track width the routed paths; a pad name or vN(x,y) marks a point on that pad's centre or on a via; arc(x,y) is an arc through that point)
1V2: length 44.4
  Top Layer w0.15: U25.J16 v2(60.71,33.28) ; 56.21,27.78 v2(56.71,27.28) ; 58.21,28.78 v2(58.71,28.28) ; U25.F6 v2(49.71,36.28) ; U25.N9 v2(52.71,28.28) ; U25.M15 v2(59.71,29.28) ; U25.K15 v2(59.71,32.28) ; U25.J12 v2(56.71,33.28) ; U25.K9 v2(52.71,32.28) ; U25.R10 v2(53.71,26.28) ; U25.V17 v2(61.71,23.28) ; U25.L16 v2(60.71,31.28) ; U25.R12 v2(56.71,26.28) ; U25.L14 v2(58.71,31.28) ; U25.E17 v2(61.71,37.28) ; U25.R8 v2(51.71,26.28) ; 54.21,27.78 v2(53.71,27.28) ; U25.K14 v2(58.71,32.28) ; U25.J11 v2(54.71,33.28) ; 57.21,27.78 v2(57.71,27.28) ; 53.21,29.78 v2(52.71,29.28) ; U25.P9 v2(52.71,27.28) ; U25.J13 v2(57.71,33.28) ; 55.21,27.78 v2(54.71,27.28) ; U25.G12 v2(55.71,34.28) ; U25.U6 v2(49.71,24.28) ; U25.J10 v2(53.71,33.28) ; U25.P14 v2(58.71,27.28) ; U25.J14 v2(58.71,33.28) ; U25.H9 v2(52.71,34.28) ; U25.L9 v2(52.71,31.28) ; U25.M14 v2(58.71,29.28)
  Top Layer w0.25: C59.2 113.1,45.2 114.73,43.57 114.73,42.53 113.6,41.4 112.41,41.4 112.11,41.7 107.7,41.7 107.1,42.3 98.6,42.3 R38.2
  vias: v1(108.7,48.8) v1(108.7,47.9) v1(108.7,47) v1(108.7,46.1) v1(108.7,45.2) v1(108.7,44.3) v1(108.7,43.4) v1(108.7,42.6) v1(109.5,48.8) v1(109.7,43.4) v1(109.7,42.6) v1(110.2,48.8) v1(110.6,43.4) v1(110.6,42.6) v1(114.3,47.7) v1(114.3,47) v1(114.3,46.3) v1(114.3,45.6) v1(114.3,44.9)
2V5: length 28.4
  Top Layer w0.15: U25.L18 v2(62.71,31.28) ; U25.F18 v2(62.71,36.28) ; U25.T6 v2(50.71,25.28) ; U25.U18 v2(62.71,24.28) ; U25.G6 50.71,35.28
  Top Layer w0.25: R35.2 98.8,54.2 107.3,54.2 107.9,53.6 112.13,53.6 112.43,53.3 113.5,53.3 114.6,54.4 114.6,55.6 113.1,57.1 C55.2
  Top Layer w0.3: v2(12.8,63) R142.1 R141.1 v2(12.8,61.5)
  vias: v1(108.7,60.7) v1(108.7,59.8) v1(108.7,58.9) v1(108.7,58) v1(108.7,57.1) v1(108.7,56.2) v1(108.7,55.3) v1(108.7,54.5) v1(109.5,60.7) v1(109.7,55.3) v1(109.7,54.5) v1(110.2,60.7) v1(110.6,55.3) v1(110.6,54.5) v1(114.3,59.6) v1(114.3,58.9) v1(114.3,58.2) v1(114.3,57.5) v1(114.3,56.8) v2(50.71,35.28)
3V3: length 153.5
  Top Layer w0.15: U25.H4 v2(47.71,34.28) ; U25.D14 v2(58.71,38.28) ; 49.21,22.78 v2(48.71,22.28) ; 83.1,13.85 v2(83.1,13) ; U25.F4 v2(47.71,36.28) ; 81.6,13.85 v2(81.6,13) ; R94.1 v2(82.3,46.65) ; U25.D4 v2(47.71,38.28) ; U25.W18 v2(62.71,22.28) ; 56.2,37.8 v2(56.7,38.3) ; U25.W9 v2(52.71,22.28) ; R149.1 v2(50.1,52.9) ; D3.2 20.7,68.5 v2(20.4,68.2) ; U25.W12 v2(56.71,22.28) ; U25.Y14 v2(58.71,21.28) ; U25.K4 v2(47.71,32.28) ; U25.D18 v2(62.71,38.28) ; U25.E8 v2(51.71,37.28) ; U25.AA6 v2(49.71,20.28) ; U25.U4 v2(47.71,24.28) ; U25.P18 v2(62.71,27.28) ; U25.D11 v2(54.71,38.28) ; v2(65.73,19.27) 65.73,19.27 U25.AB21 ; R150.2 v2(62.3,57.65) ; 84.6,13.85 v2(84.6,13) ; U25.A2 45.7,41.3 v2(45.7,41.3) ; U25.E19 v2(63.71,37.28) ; U25.V19 v2(63.71,23.28) ; U25.Y19 v2(63.71,21.28) ; U25.D9 v2(52.71,38.28) ; v2(13.5,68.2) 13.8,68.5 D2.2 ; v2(65.73,41.3) 65.72,41.3 U25.A21 ; U25.T19 v2(63.71,25.28) ; v2(45.7,19.27) 45.7,19.27 U25.AB2 ; U25.G19 v2(63.71,35.28) ; U25.R4 v2(47.71,26.28) ; U25.D16 v2(60.71,38.28) ; 86.1,13.85 v2(86.1,13) ; U25.D5 v2(48.71,38.28) ; U25.W16 v2(60.71,22.28) ; U25.W4 v2(47.71,22.28) ; U25.N4 v2(47.71,28.28) ; U25.L19 v2(63.71,31.28) ; U25.J20 v2(64.71,33.28) ; U25.W11 v2(54.71,22.28)
  Top Layer w0.2: v2(18.85,45) R122.2 R123.2 R124.2 v2(18.85,40.4) ; v2(18.9,48.9) 18.9,49.65 R121.2 R120.2 v2(19.6,51.2)
  Top Layer w0.25: R102.1 v1(45.3,70) ; R31.2 98.8,66.3 107.3,66.3 107.9,65.7 112.17,65.7 112.57,65.3 113.5,65.3 114.6,66.4 114.6,67.6 113.1,69.1 C37.2
  Top Layer w0.3: v1(37.2,28) 37.2,27.97 R119.2 38.81,28.51 38.9,28.51 ; U15.27 91.06,31.2 C130.1 v3(91.7,32.1) ; U16.8 44.37,47.63 C119.2 v3(43.9,48.9) ; U15.1 69.06,32.4 v3(69,32.4) ; R137.1 v1(47.1,13.95) ; 21.32,42.23 v1(22.9,42.23) ; 21.32,34.23 v1(22.9,34.23) ; 33.53,57.25 v1(33.53,58.8) ; U14.3 71.2,15.4 C124.1 v3(72.3,15.3) ; R139.1 v1(42,13.95) ; v1(60.3,59.1) C177.1 59.37,59.07 U2.8 ; U14.14 C126.1 v3(79.1,15.3) ; v3(68.5,15.3) C123.1 69.6,15.4 U14.1 ; v3(67.5,45.9) C118.1 67.07,47.13 U16.24 ; U14.27 C127.1 v3(89.5,15.3) ; v3(79.4,45.2) C129.1 U15.43 ; L2.2 v1(21.5,59.8) ; v3(75.1,15.3) C125.1 U14.9 ; U23.16 53.44,70.11 C152.1 v1(53.37,69.14) ; R135.1 v1(7.7,6.7) ; C174.1 C175.2 v1(15.9,34.6) ; U18.20 28.28,48.02 C151.2 28.2,48.6 v1(27.8,49) ; v1(39.5,29.1) 38.91,28.51 38.9,28.51 ; 32.88,57.25 v1(32.88,55.8) ; U14.49 v3(73.6,29.9) ; v1(30.5,38.1) C150.1 29.58,38.13 U19.20 ; R136.1 v1(49.6,13.95) ; 38.72,57.25 v1(38.72,58.8) ; U15.9 v3(76,33.2) ; v1(18.4,46.7) C176.1 17.45,46.75 CARD1.6 ; U14.43 v3(78.4,29.9) ; R138.1 v1(44.5,13.95) ; X1.4 40.27,27.13 38.9,28.51 ; R134.2 v1(42.7,69.4) ; U15.49 C128.1 v3(74.6,45.2) ; 36.78,57.25 v1(36.78,58.8) ; U15.14 v3(80,33.2) ; v1(28.9,54.7) C178.1 30,55.7 30.28,55.98 30.28,57.25 ; U23.4 v1(49.63,76.5) ; LED10.2 v1(19.7,4.4) ; U15.3 v3(71.2,33.2)
  Inner3 w0.2: v2(63.71,25.28) 62.71,26.28 v2(62.71,27.28)
  Bottom Layer w0.3: v3(69,32.4) 68.3,31.7 C131.1 ; C133.1 v3(76,33.2) ; C121.1 80,32.3 v3(80,33.2) ; C122.1 v3(73.6,29.9) ; C132.1 v3(78.4,29.9) ; C134.1 v3(71.2,33.2)
  vias: v1(108.7,72.7) v1(108.7,71.8) v1(108.7,70.9) v1(108.7,70) v1(108.7,69.1) v1(108.7,68.2) v1(108.7,67.3) v1(108.7,66.5) v1(109.5,72.7) v1(109.7,67.3) v1(109.7,66.5) v1(110.2,72.7) v1(110.6,67.3) v1(110.6,66.5) v1(114.3,71.6) v1(114.3,70.9) v1(114.3,70.2) v1(114.3,69.5) v1(114.3,68.8)
5V: length 24.5
  Top Layer w0.3: v1(20.2,25.3) 20.4,25.1 D1.2 ; D4.2 v1(4.8,76)
  Top Layer w0.5: U4.3 102.5,71.2 C165.2 ; C95.1 15.65,28.5 USB1.1 17.4,28.6 C173.2
  Top Layer w0.8: R125.1 102.5,74.8 C165.2
  Top Layer w1: C43.2 C44.2
  Bottom Layer w0.3: USB1.1 16.1,28.6 19.4,25.3 v1(20.2,25.3)
5VOUT:
  vias: v1(71.6,70.2) v1(71.6,69.4) v1(72.4,70.2) v1(72.4,69.4) v1(73.3,70.2) v1(73.3,69.4) v1(74.1,70.2) v1(74.1,69.4) v1(74.9,70.2) v1(74.9,69.4) v1(75.8,71.8) v1(75.8,71) v1(75.8,70.2) v1(75.8,69.4)
GND: length 231.2
  Top Layer w0.15: U25.E18 v2(62.71,37.28) ; U25.K20 v2(64.71,32.28) ; U25.J9 v2(52.71,33.28) ; U25.J15 v2(59.71,33.28) ; 54.21,29.78 v2(53.71,29.28) ; U25.A1 44.7,41.3 v2(44.7,41.3) ; U25.C9 v2(52.71,39.28) ; U25.P8 v2(51.71,27.28) ; U25.L11 v2(54.71,31.28) ; U25.C16 v2(60.71,39.28) ; U25.AA2 45.7,20.27 v2(45.7,20.27) ; U25.Y5 v2(48.71,21.28) ; U25.M12 v2(56.71,29.28) ; 59.21,30.78 v2(59.71,31.28) ; U25.L3 v2(46.71,31.28) ; U25.K16 v2(60.71,32.28) ; U25.V18 v2(62.71,23.28) ; U25.P19 v2(63.71,27.28) ; U25.C14 v2(58.71,39.28) ; U25.Y18 v2(62.71,21.28) ; U25.U5 v2(48.71,24.28) ; U25.C11 v2(54.71,39.28) ; U25.Y9 v2(52.71,21.28) ; 55.21,29.78 v2(54.71,29.28) ; U25.J19 v2(63.71,33.28) ; U25.L10 v2(53.71,31.28) ; U25.L13 v2(57.71,31.28) ; U25.D3 v2(46.71,38.28) ; U25.C18 v2(62.71,39.28) ; U25.AA22 v2(66.9,20.78) ; 56.21,28.78 v2(56.71,28.28) ; v2(12.9,68.8) 12.6,68.5 D2.5 ; U25.K10 v2(53.71,32.28) ; U25.F3 v2(46.71,36.28) ; D3.5 19.5,68.5 v2(19.8,68.8) ; U25.A22 66.73,41.3 v2(66.73,41.3) ; U25.U3 v2(46.71,24.28) ; U25.W3 v2(46.71,22.28) ; U25.L12 v2(56.71,31.28) ; U25.R11 v2(54.71,26.28) ; U25.Y20 v2(64.71,21.28) ; U25.R9 v2(52.71,26.28) ; U25.F12 v2(56.71,36.28) ; 56.2,38.8 v2(56.7,39.3) ; U25.K13 v2(57.71,32.28) ; U25.C5 48.71,39.28 ; U25.K12 v2(56.71,32.28) ; U25.T20 v2(64.71,25.28) ; U25.R3 v2(46.71,26.28) ; 57.21,28.78 v2(57.71,28.28) ; U25.N11 v2(54.71,28.28) ; U25.M13 v2(57.71,29.28) ; U25.Y11 v2(54.71,21.28) ; U25.Y12 v2(56.71,21.28) ; U25.AB1 44.7,19.27 v2(44.7,19.27) ; U25.F5 v2(48.71,36.28) ; U25.R13 v2(57.71,26.28) ; U25.E20 v2(64.71,37.28) ; U25.K3 v2(46.71,32.28) ; U25.N10 v2(53.71,28.28) ; U25.K11 v2(54.71,32.28) ; v2(66.73,19.27) 66.73,19.27 U25.AB22 ; U25.Y15 v2(59.71,21.28) ; v2(49.7,19.2) 49.7,19.27 U25.AB6 ; 56.21,33.78 v2(56.71,34.28) ; U25.H3 v2(46.71,34.28) U25.G2 ; U25.L17 v2(60.71,30.28) ; U25.L20 v2(64.71,31.28) ; U25.N3 v2(46.71,28.28) ; U25.D8 v2(51.71,38.28) ; U25.G20 v2(64.71,35.28) ; U25.H13 v2(57.71,34.28) ; U25.V20 v2(64.71,23.28) ; U25.N15 v2(59.71,28.28) ; U25.M17 v2(60.71,29.28) ; U25.Y16 v2(60.71,21.28)
  Top Layer w0.25: HDMI1.17 18.3,78.2 v1(17.9,78.6) ; HDMI1.8 v1(13.8,78.6) ; HDMI1.11 v1(15.3,78.6) ; HDMI1.2 v1(10.8,78.6) ; HDMI1.5 v1(12.3,78.6)
  Top Layer w0.3: U15.46 v3(76,44.4) ; C163.2 v1(23.2,62.8) ; v1(15.6,51.25) CARD1.10 13.9,50.85 v1(13.9,50.1) ; U19.3 v1(22.9,36.83) ; SW5.3 v1(47.18,1.5) ; R133.1 v1(33.7,13.05) ; CARD1.11 v1(4.7,52.4) ; CARD1.11 v1(4.7,50.2) ; CARD1.11 v1(6.4,51.25) ; CARD1.11 v1(3.1,51.25) ; v1(37.3,28.9) 37.31,28.9 37.91,29.5 ; R151.1 v1(27.45,63.4) ; v1(13,36.6) 14.25,36.6 CARD1.13 ; U15.54 v3(69.6,44.4) ; v1(36,31.9) 35.39,31.3 34.2,32.49 X5.4 35.8,34.58 35.8,34.71 v1(36.4,34.1) ; X5.2 31.61,32.8 v1(32.7,32.8) ; CARD1.12 v1(6.3,35.75) ; CARD1.12 v1(4.7,34.7) ; CARD1.12 v1(3.1,35.75) ; CARD1.12 v1(4.7,36.8) ; R101.1 v1(35.9,13.05) ; SW5.2 v1(44.64,1.5) ; R148.2 v2(11.95,65.3) ; C151.1 v1(26,48.1) ; R131.1 v1(31.5,13.05) ; R130.1 v1(29.3,13.05) ; U14.54 69.6,29.1 v3(69.1,29.6) ; U26.2 38.1,64.13 v1(38.1,62.6) ; 34.17,57.25 v1(34.17,55.8) ; U15.52 v3(71.2,44.4) ; C128.2 v3(74.6,46.6) ; C176.2 v1(18.4,48.1) ; v3(67.5,48.9) C118.2 67.03,47.63 U16.25 ; SW5.4 v1(49.72,1.5) ; 32.22,57.25 v1(32.22,58.8) ; C130.2 91.6,29.9 v3(90.8,29.9) 90.4,29.5 U14.28 ; v1(33.43,51.3) 33.43,52.17 34.86,52.17 X8.4 ; U16.9 44.33,47.13 C119.1 v3(43.9,45.9) ; v1(36.5,42.1) 35.89,42.71 35.8,42.71 35.8,42.62 X6.4 34.19,40.49 C156.1 35.96,39.9 v1(36,39.9) ; U23.1 v1(53.44,76.5) ; C127.2 v3(89.5,13.9) ; C178.2 v1(27.5,54.7) ; R129.1 v1(27.1,13.05) ; U15.28 v3(90.4,44.4) ; U15.41 v3(80,44.4) ; USB2.1 52.68,80.63 USB2.13 ; X1.2 v1(39.87,23.48) ; U18.10 v1(21.32,39.7) ; C159.1 v1(38.73,54.4) ; C164.2 v1(22.2,57.7) ; U15.12 v3(78.4,33.2) ; CARD1.13 v1(14.3,35.4) ; CARD1.13 v1(14.3,38) ; C129.2 v3(79.4,46.6) ; C177.2 v1(60.3,60.5) ; C125.2 v3(75.1,13.9) ; U14.52 v3(71.2,29.9) ; R99.2 v1(55,85.2) ; U26.11 v1(32.22,62.6) ; C124.2 v3(70.4,13.9) C123.2 ; U14.12 v3(78.4,16.1) ; U14.46 v3(76,29.9) ; X6.2 31.67,40.9 v1(32.7,40.9) ; U14.6 v3(73.6,16.1) ; 34.83,57.25 v1(34.83,58.8) ; U18.3 v1(22.9,44.83) ; R140.1 v1(22.7,13.05) ; D1.5 v1(18.1,25.1) ; v1(32.8,37.5) 32.5,37.2 C150.2 ; R128.1 v1(24.9,13.05) ; R132.1 v1(20.3,13.05) ; R98.2 v1(42.8,85.2) ; X8.2 36.85,53.65 v1(36.1,52.9) ; USB2.12 45.12,80.63 USB2.14 ; U19.10 v1(21.32,31.7) ; C126.2 v3(79.1,13.9) ; SW5.1 v1(42.1,1.5) ; C98.1 v1(42.5,65.5) ; U15.6 v3(73.6,33.2) ; C152.2 v1(51.17,70.04) ; R100.1 v1(38.1,13.05) ; U14.41 v3(80,29.9)
  Top Layer w0.5: C42.1 70.1,73.3 v1(69.3,73.3) ; C42.1 v1(69.4,74.6) ; C42.1 C41.1 C40.1 ; v1(110.8,13.3) 110.8,12.23 U7.5 v1(110,12.2) ; v1(114,55.1) C55.1 v1(112.9,54) ; C40.1 v1(74.4,74.7) ; C40.1 v1(75.5,73.6) ; C44.1 v1(99.3,76.9) ; v1(112.9,66) C37.1 v1(114,67.1) ; C61.1 v1(104.3,52.9) ; v1(103.8,61.3) 103.5,61 C166.1 ; v1(103.8,49.3) 103.5,49 C167.1 ; v1(111.83,13.3) U7.4 v1(112.6,12.2) ; C54.1 v1(114.1,61.3) ; C54.1 v1(112.9,62.4) ; C54.1 v1(111.8,61.3) ; C58.1 v1(112.9,50.5) ; C58.1 v1(114.1,49.4) ; C58.1 v1(111.8,49.4) ; C60.1 v1(104.3,50.9) ; C50.1 v1(70.6,62.3) ; C173.1 v1(21.6,30.4) ; v1(21.6,29.6) 21.6,28.6 C95.2 ; C38.1 v1(111.8,73.3) ; C38.1 v1(112.9,74.4) ; C38.1 v1(114.1,73.3) ; R34.2 v1(97.7,60.2) ; C48.1 v1(78.8,60.3) ; v1(114,43.2) C59.1 v1(112.9,42.1) ; v1(96.5,73.3) 97.6,73.3 R30.1 ; C51.1 v1(104.3,64.9) ; C52.1 v1(104.3,62.9) ; R37.2 v1(97.7,48.1) ; C43.1 v1(99.3,74.9) ; C49.1 v1(59.7,73.8) ; C171.2 v1(67.5,71.8) ; C165.1 v1(100.3,73) ; C47.1 v1(68,73.7)
  Bottom Layer w0.3: C131.2 68.9,29.6 v3(69.1,29.6) ; C122.2 v3(73.6,33.2) ; C134.2 v3(71.2,29.9) ; C132.2 v3(78.4,33.2) ; C121.2 80,30.7 v3(80,29.9) ; C133.2 v3(76,29.9)
  vias: v1(66.7,69.7) v1(66.7,65.4) v1(67.4,65.4) v1(67.5,69.7) v1(68.2,69.7) v1(68.2,65.4) v1(102.3,68.4) v1(102.3,56.4) v1(102.3,44.4) v1(103.1,68.4) v1(103.1,56.4) v1(103.1,44.4) v2(48.71,39.28)
(no net): length 71.7
  Top Layer w0.15: 53.4,15.8 52.85,16.35 52.85,17.55 52.21,18.19 52.21,19.78 ; U25.AB17 61.21,18.38 ; 53.21,19.78 53.21,18.19 53.6,17.8 53.6,16.8 54.2,16.2 ; 59.5,16.9 59.21,17.19 59.21,19.78 ; 60.21,19.78 60.21,18.38 ; U25.AA18 62.71,20.28 62.71,18.38 ; 52.5,15.3 51.8,16 51.8,17.5 51.21,18.09 51.21,19.78 ; U25.AB18 62.21,18.38 ; 63.71,18.38 63.71,20.28 U25.AA19 ; 53.9,15.9 53.2,16.6 53.2,17.7 52.71,18.19 52.71,20.28 U25.AA9 ; 54.21,19.78 54.21,18.38 ; 52.85,15.75 52.3,16.3 52.3,17.6 51.71,18.19 51.71,20.28 U25.AA8 ; U25.AA16 60.71,20.28 60.71,18.38 ; U25.AA14 58.71,20.28 58.71,17.09 59,16.8 ; 60,16.9 59.71,17.19 59.71,20.28 U25.AA15 ; 57.8,16.2 57.21,16.79 57.21,19.78 ; U25.AA10 53.71,20.28 53.71,18.19 54,17.9 54,17 54.5,16.5 ; 58.5,16.7 58.21,16.99 58.21,19.78 ; U25.AB20 64.21,18.38 ; U25.AA17 61.71,20.28 61.71,18.38 ; U25.AB19 63.21,18.38 ; U25.AA13 57.71,20.28 57.71,16.89 58.1,16.5 ; U25.G5 49.21,34.82
B+: length 1.2
  Top Layer w0.25: R32.1 108.5,11.7
  vias: v1(74,57.9) v1(74,57.2) v1(75.1,57.9) v1(75.1,57.2) v1(76.2,57.9) v1(76.2,57.2) v1(77.3,57.9) v1(77.3,57.2)
B-:
  vias: v1(111.3,9.5) v1(112.1,9.5) v1(112.9,9.5) v1(112.9,8.7) v1(112.9,7.9) v1(112.9,7.2) v1(112.9,6.5) v1(113.7,9.5) v1(113.7,8.7) v1(113.7,7.9) v1(113.7,7.2) v1(113.7,6.5)
BTN_RESET: length 48.2
  Top Layer w0.15: v2(43,26.78) U25.R1
  Top Layer w0.3: R135.2 10.8,5.95 SW4.1
  Bottom Layer w0.15: 19.95,14.95 16.5,11.5 16.5,8.4 15.8,7.7 14.65,7.7 SW4.1 ; 19.2,18.3 27.68,26.78 v2(43,26.78)
CH376_1_CLK: length 24.9
  Top Layer w0.15: 28.28,34.23 v2(29.9,34.23) ; U25.N5 v2(48.71,28.28)
  Bottom Layer w0.15: v2(48.71,28.28) 48.2,28.8 46.5,28.8 39.5,35.8 32.7,35.8 31.12,34.23 v2(29.9,34.23)
CH376_1_CS: length 24.4
  Top Layer w0.15: U19.13 v2(29.9,33.58) ; U25.P4 v2(47.71,27.28)
  Bottom Layer w0.15: v2(47.71,27.28) 47.2,27.8 46.4,27.8 46.1,28.1 46.1,28.5 39.3,35.3 32.7,35.3 30.97,33.58 v2(29.9,33.58)
CH376_1_INT: length 29.8
  Top Layer w0.15: 47.21,29.78 v2(46.71,29.28)
  Top Layer w0.3: U19.1 v1(24.1,38.13)
  Bottom Layer w0.15: v1(24.1,38.13) 25.58,38.13 27.5,36.2 39.8,36.2 v2(46.71,29.28)
CH376_1_MISO: length 23.1
  Top Layer w0.15: U25.P1 42.82,27.78 37.5,33.1 37.5,36.1 36.6,37 33.3,37 31.83,35.53 28.28,35.53
CH376_1_MOSI: length 24.6
  Top Layer w0.15: U25.P2 45.71,27.28 42.82,27.28 37.2,32.9 37.2,35.9 36.4,36.7 33.5,36.7 31.67,34.88 U19.15
CH376_2_CLK: length 31.4
  Top Layer w0.15: 28.28,42.23 30.03,42.23 33.8,46 35.4,46 38.1,43.3 38.1,33.5 42.82,28.78 U25.N1
CH376_2_CS: length 32.8
  Top Layer w0.15: U18.13 29.88,41.58 34,45.7 35.2,45.7 37.8,43.1 37.8,33.3 42.82,28.28 45.71,28.28 U25.N2
CH376_2_INT: length 37.8
  Top Layer w0.15: 48.21,29.78 v2(47.71,29.28)
  Top Layer w0.3: v1(26.4,44.8) 25.08,46.13 U18.1
  Bottom Layer w0.15: v1(26.4,44.8) 38.2,44.8 39.1,43.9 39.1,37.5 46.5,30.1 46.9,30.1 v2(47.71,29.28)
CH376_2_MISO: length 30.9
  Top Layer w0.15: 45.21,29.78 42.82,29.78 38.7,33.9 38.7,43.7 35.8,46.6 33.4,46.6 30.33,43.53 28.28,43.53
CH376_2_MOSI: length 32.3
  Top Layer w0.15: 46.21,29.78 45.71,29.28 42.82,29.28 38.4,33.7 38.4,43.5 35.6,46.3 33.6,46.3 30.17,42.88 U18.15
CLK_50M: length 4.7
  Top Layer w0.2: U25.T2 45.71,25.28 41.99,25.28 X1.3
DAC_D0: length 15.1
  Top Layer w0.15: 15.32,9.25 v2(15.32,8.4) ; U25.AA7 50.71,20.28 50.71,17.99 51,17.7 51,16.7
  Bottom Layer w0.15: v2(15.32,8.4) 15.32,12.92 15.9,13.5 17.9,13.5 19.7,15.3
DAC_D1: length 17
  Top Layer w0.15: 13.82,9.25 v2(13.82,8.4) ; 51.21,21.78 v2(50.71,21.28)
  Bottom Layer w0.15: 19.6,15.7 17.8,13.9 14.4,13.9 13.82,13.32 v2(13.82,8.4) ; v2(50.71,21.28) 50.71,17.5
DAC_D2: length 19.3
  Top Layer w0.15: 12.32,9.25 v2(12.32,8.4) ; 51.21,22.78 v2(50.71,22.28)
  Bottom Layer w0.15: v2(50.71,22.28) 50.2,21.77 50.2,17.7 ; 19.45,16.05 17.7,14.3 13.7,14.3 12.32,12.92 v2(12.32,8.4)
DAC_D3: length 20.2
  Top Layer w0.15: 50.21,21.78 v2(49.71,21.28) ; 10.82,9.25 v2(10.82,8.4)
  Bottom Layer w0.15: 49.9,17.2 49.2,17.9 49.2,20.77 v2(49.71,21.28) ; 19.4,16.5 17.6,14.7 13.5,14.7 10.82,12.02 v2(10.82,8.4)
DAC_D4: length 23.6
  Top Layer w0.15: 50.21,22.78 v2(49.71,22.28) ; 9.32,9.25 v2(9.32,8.4)
  Bottom Layer w0.15: v2(9.32,8.4) 9.32,11.12 13.3,15.1 17.5,15.1 19.4,17 ; v2(49.71,22.28) 49.23,21.8 48.6,21.8 48.2,21.4 48.2,17.9 49.2,16.9
DAC_D5: length 20.1
  Top Layer w0.15: 49.21,19.78 49.21,17.39 49.7,16.9 ; 7.82,9.25 v2(7.82,8.4)
  Bottom Layer w0.15: v2(7.82,8.4) 7.82,10.22 13.1,15.5 17.4,15.5 19.2,17.3
DAC_D6: length 20.8
  Top Layer w0.15: 48.71,18.38 48.71,20.28 U25.AA5 ; 6.32,9.25 v2(6.32,8.4)
  Bottom Layer w0.15: v2(6.32,8.4) 6.32,9.32 12.9,15.9 17.3,15.9 19.2,17.8
DAC_D7: length 21.5
  Top Layer w0.15: 47.71,18.38 47.71,20.28 U25.AA4 ; 4.82,9.25 v2(4.82,8.4)
  Bottom Layer w0.15: v2(4.82,8.4) 12.72,16.3 17.2,16.3 18.9,18
ETH_CLK: length 33
  Top Layer w0.15: 47.21,39.78 46.71,40.28 v2(46.71,42.8)
  Top Layer w0.2: v2(43.3,55.4) 43.3,56.6 43.2,56.7 43.2,57.9 41.2,59.9 35.7,59.9 34.17,61.43 U26.8
  Bottom Layer w0.15: v2(43.3,55.4) 43.3,52.6 44.8,51.1 44.8,44.71 v2(46.71,42.8)
ETH_CS: length 34.5
  Top Layer w0.15: U25.C3 v2(46.71,39.28)
  Top Layer w0.2: U26.9 33.53,61.08 35.1,59.5 41,59.5 42.8,57.7 v2(42.8,56.2)
  Bottom Layer w0.15: v2(46.71,39.28) 46.71,41.59 44.5,43.8 44.5,51 42.8,52.7 v2(42.8,56.2)
ETH_INT: length 30.3
  Top Layer w0.15: v2(48.21,42.8) U25.A4
  Top Layer w0.2: U26.4 36.78,62.33 37.1,62 40.9,62 44.4,58.5 44.4,57.6 44.8,57.2 v2(44.8,56.2)
  Bottom Layer w0.15: v2(48.21,42.8) 48.21,42.89 45.7,45.4 45.7,51.4 44.8,52.3 v2(44.8,56.2)
ETH_MISO: length 32.4
  Top Layer w0.15: 48.21,39.78 47.71,40.28 v2(47.71,42)
  Top Layer w0.2: v2(44.3,55.4) 44.3,57.1 44,57.4 44,58.3 41.6,60.7 36.9,60.7 35.47,62.13 U26.6
  Bottom Layer w0.15: v2(47.71,42) 47.71,42.99 45.4,45.3 45.4,51.3 44.3,52.4 v2(44.3,55.4)
ETH_MOSI: length 33.9
  Top Layer w0.15: U25.C4 v2(47.71,39.28)
  Top Layer w0.2: U26.7 34.83,61.78 36.3,60.3 37.12,60.3 37.13,60.3 41.4,60.3 43.6,58.1 43.6,56.9 43.8,56.7 v2(43.8,56.2)
  Bottom Layer w0.15: v2(43.8,56.2) 43.8,52.5 45.1,51.2 45.1,45.2 47.2,43.1 47.2,39.8 v2(47.71,39.28)
FPGA_ASDO: length 32.2
  Top Layer w0.15: U2.5 54.66,53.77 53.2,52.3 49.4,52.3 48.9,51.8 44.7,51.8 42.7,49.8 42.7,38.9 43.81,37.78 45.21,37.78
FPGA_CONF_DONE: length 12.8
  Top Layer w0.15: U25.M18 v2(62.71,29.28)
  Top Layer w0.3: LED1.2 v1(21.9,4.4)
  Bottom Layer w0.15: v1(21.9,4.4) 21.9,10.2 23.5,11.8 23.5,14.9
FPGA_DATA0: length 35.5
  Top Layer w0.15: v2(39,45.6) 39.9,44.7 39.9,34.7 42.82,31.78 45.21,31.78 ; v2(50.3,56.3) 50.31,56.31 52.28,56.31
  Inner2 w0.15: v2(39,45.6) 49.7,56.3 v2(50.3,56.3)
FPGA_DCLK: length 41.9
  Top Layer w0.15: U25.K2 45.71,32.28 42.82,32.28 40.2,34.9 40.2,45 v2(39.6,45.6) ; v2(54.1,55) 59.33,55 U2.6
  Inner2 w0.15: v2(39.6,45.6) 49,55 v2(54.1,55)
FPGA_NCONFIG: length 15.4
  Top Layer w0.15: U25.K5 48.71,32.28
  Bottom Layer w0.15: SW2.1 16.9,4.55 16.9,11.2 20.8,15.1 22.3,15.1
  vias: v2(48.71,32.28)
FPGA_NCSO: length 31.1
  Top Layer w0.15: U25.E2 45.71,37.28 43.81,37.28 42.4,38.7 42.4,49.9 44.6,52.1 48.7,52.1 49.2,52.6 49.2,56.4 50.38,57.58 U2.1
HDMI_CLKN: length 59.2
  Top Layer w0.15: C135.1 21.9,71.1 21.9,70.2 22.2,69.9 22.2,67.8 21.95,67.55 D3.1 20.75,67.55 v2(20.4,67.2) ; U25.B1 v2(43.81,39.78)
  Bottom Layer w0.15: v2(20.4,67.2) 21.25,68.05 21.82,68.05 22.49,67.39 22.49,66.91 21.88,66.3 18.58,66.3 17.9,65.63 17.9,60.58 24.78,53.7 29.78,53.7 33.39,50.09 38.49,50.09 41.9,46.67 41.9,40.7 42.82,39.78 v2(43.81,39.78)
HDMI_CLKP: length 57.6
  Top Layer w0.15: U25.B2 45.71,40.28 v2(43.21,40.28) ; v2(20.4,69.2) 20.65,69.45 D3.3 21.6,69.8 21.6,71.1 C142.1
  Bottom Layer w0.15: v2(43.21,40.28) 42.74,40.28 42.2,40.83 42.2,46.8 38.61,50.39 33.51,50.39 29.9,54 24.9,54 18.2,60.7 18.2,65.5 18.7,66 22,66 22.79,66.79 22.79,67.51 21.95,68.35 21.25,68.35 v2(20.4,69.2)
HDMI_D0N: length 55.3
  Top Layer w0.15: U25.C1 v2(43.81,38.78) ; v2(19.8,69.8) 19.45,69.45 D3.4 18.5,69.9 18.5,71.1 C141.1
  Bottom Layer w0.15: v2(43.81,38.78) 42.94,38.78 41.3,40.43 41.3,46.4 38.2,49.5 33.1,49.5 29.5,53.1 24.5,53.1 17.3,60.3 17.3,68.33 17.97,69 19,69 v2(19.8,69.8)
HDMI_D0P: length 58
  Top Layer w0.15: C140.1 18.2,71.1 18.2,70.2 18,70 18,67.8 18.25,67.55 D3.6 19.45,67.55 v2(19.8,67.9) ; v2(43.2,39.28) 45.71,39.28 U25.C2
  Bottom Layer w0.15: v2(43.2,39.28) 42.87,39.28 41.6,40.55 41.6,46.53 38.32,49.8 33.22,49.8 29.62,53.4 24.62,53.4 17.6,60.43 17.6,68.2 18.1,68.7 19,68.7 v2(19.8,67.9)
HDMI_D1N: length 61
  Top Layer w0.15: v2(13.5,67.2) 13.85,67.55 D2.1 15.05,67.55 15.3,67.8 15.3,69.7 15.1,69.9 15.1,71.1 C139.1 ; U25.E3 v2(46.71,37.28)
  Bottom Layer w0.15: v2(46.71,37.28) 46.71,37.35 46.59,37.47 43.35,37.47 40.7,40.13 40.7,46.08 37.88,48.9 32.78,48.9 29.17,52.5 24.17,52.5 16.7,59.98 16.7,67 15.7,68 14.3,68 v2(13.5,67.2)
HDMI_D1P: length 59.5
  Top Layer w0.15: U25.E4 v2(47.71,37.28) ; v2(13.5,69.1) 13.85,69.45 D2.3 14.8,69.9 14.8,71.1 C138.1
  Bottom Layer w0.15: v2(47.71,37.28) 47.22,37.78 43.47,37.78 41,40.25 41,46.2 38,49.2 32.9,49.2 29.3,52.8 24.3,52.8 17,60.1 17,67.13 15.83,68.3 14.3,68.3 v2(13.5,69.1)
HDMI_D2N: length 62.3
  Top Layer w0.15: U25.F1 43.52,35.78 v2(42.5,36.8) ; C137.1 11.7,71.1 11.7,69.8 D2.4 12.55,69.45 v2(12.9,69.8)
  Bottom Layer w0.15: v2(12.9,69.8) 12.1,69 11.17,69 10.7,68.53 10.7,67.78 12.17,66.3 15.3,66.3 16.1,65.5 16.1,59.7 23.9,51.9 28.9,51.9 32.5,48.3 37.6,48.3 40.1,45.8 40.1,39.88 42.5,37.47 v2(42.5,36.8)
HDMI_D2P: length 64.9
  Top Layer w0.15: U25.F2 45.71,36.28 43.81,36.28 v2(43.3,36.8) ; C136.1 11.4,71.1 11.4,70.1 11.1,69.8 11.1,67.8 11.35,67.55 D2.6 12.55,67.55 v2(12.9,67.9)
  Bottom Layer w0.15: v2(12.9,67.9) 12.1,68.7 11.3,68.7 11,68.4 11,67.9 12.3,66.6 15.42,66.6 16.4,65.63 16.4,59.83 24.03,52.2 29.03,52.2 32.62,48.6 37.72,48.6 40.4,45.93 40.4,40 43.3,37.1 v2(43.3,36.8)
IO_SW1: length 41.2
  Top Layer w0.15: 48.8,12.45 49.45,12.45 50.3,13.3 50.3,14.3 48.7,15.9 48.7,18
  Top Layer w0.2: v2(29.3,15.2) 32.5,18.4 36.6,18.4 42.98,24.78 U25.U1
  Top Layer w0.25: 48.8,12.45 48.8,10.51 SW5.5
  Bottom Layer w0.2: v2(29.3,15.2) 27.7,13.6 27.7,8 24.7,5
